# EAGLE design BudgetCANv2.0 (EAGLE 9.6.1)
Therm
CNAME: CANable USB<=>CAN; CREVISION: 0.1; DESIGNER: Ethan Zonca
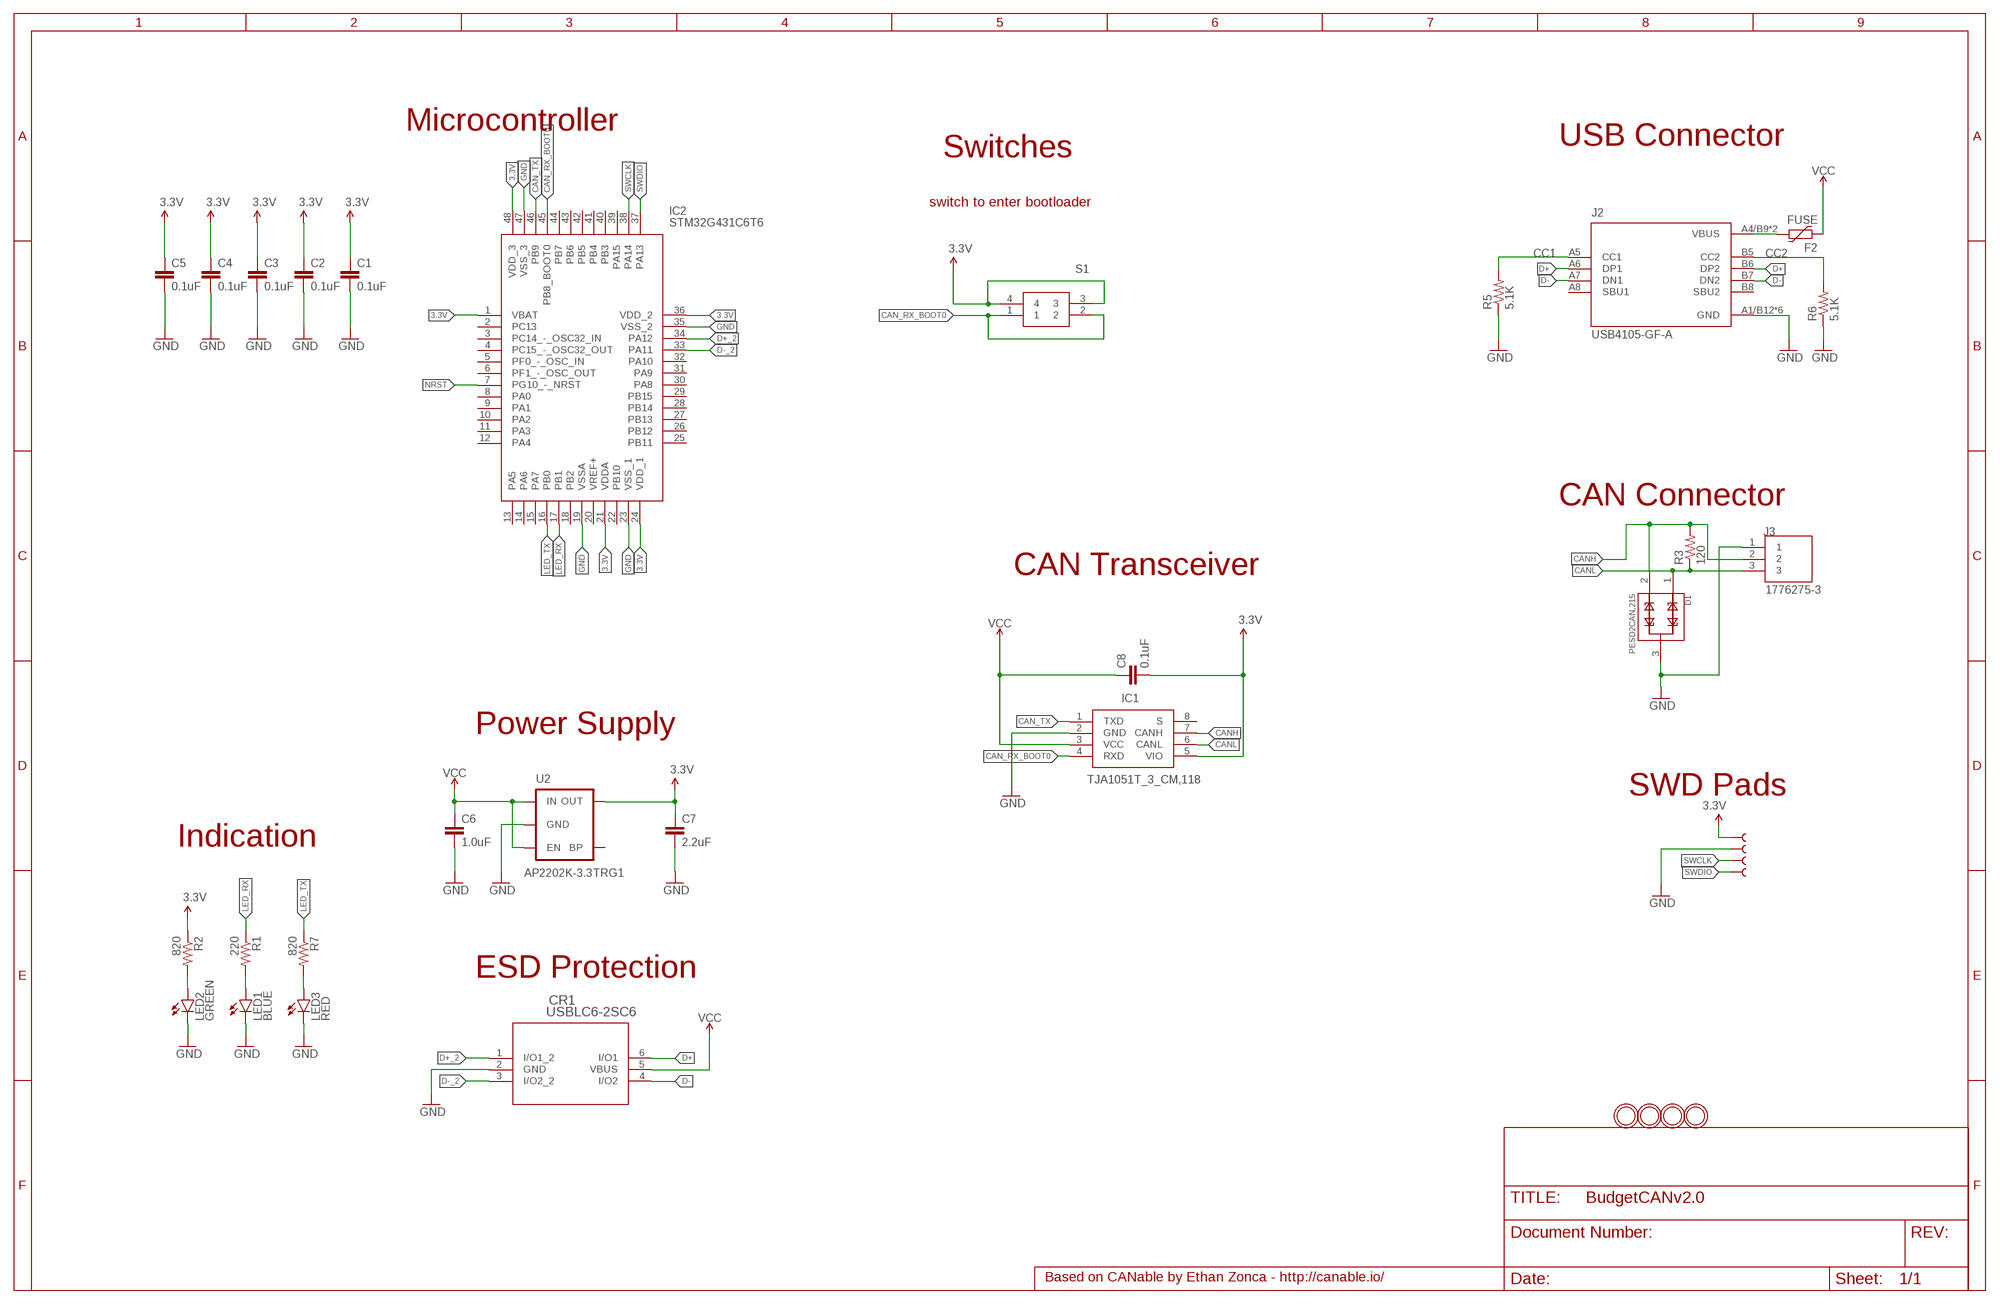
[diagram p0: schematic, sheet 1]

## Parts
C1  0.1uF  CAP0603-CAP  [0603-CAP]
C2  0.1uF  CAP0603-CAP  [0603-CAP]
C3  0.1uF  CAP0603-CAP  [0603-CAP]
C4  0.1uF  CAP0603-CAP  [0603-CAP]
C5  0.1uF  CAP0603-CAP  [0603-CAP]
C6  1.0uF  CAP0603-CAP  [0603-CAP]
C7  2.2uF  CAP0603-CAP  [0603-CAP]
C8  0.1uF  CAP0603-CAP  [0603-CAP]
CR1  USBLC6-2SC6  [SOT23-6L]
D1  PESD2CAN,215  [SOT95P230X110-3N]
F2  FUSE  FUSE_PTC-0805  [PTC0805]
IC1  TJA1051T_3_CM,118  [SOIC127P600X175-8N]
IC2  STM32G431C6T6  [QFP50P900X900X160-48N]
J2  USB4105-GF-A  [GCT_USB4105-GF-A]
J3  1776275-3  [TE_1776275-3]
LED1  BLUE  LED0603  [LED-0603]
LED2  GREEN  LED0603  [LED-0603]
LED3  RED  LED0603  [LED-0603]
R1  220  RESISTOR0603-RES  [0603-RES]
R2  820  RESISTOR0603-RES  [0603-RES]
R3  120  RESISTOR0603-RES  [0603-RES]
R5  5.1K  RESISTOR0603-RES  [0603-RES]
R6  5.1K  RESISTOR0603-RES  [0603-RES]
R7  820  RESISTOR0603-RES  [0603-RES]
S1  KMR631NGULCLFS  [KMR621NG]
TP1  TEST-POINT3X5  [PAD.03X.05]
TP2  TEST-POINT3X5  [PAD.03X.05]
TP3  TEST-POINT3X5  [PAD.03X.05]
TP4  TEST-POINT3X5  [PAD.03X.05]
U2  AP2202K-3.3TRG1  MIC52053.3V  [SOT23-5]
U$2  MOUNTINGHOLE3.0THIN  [MOUNTINGHOLE_3.0_PLATEDTHIN]
U$3  MOUNTINGHOLE3.0THIN  [MOUNTINGHOLE_3.0_PLATEDTHIN]
U$4  MOUNTINGHOLE3.0THIN  [MOUNTINGHOLE_3.0_PLATEDTHIN]
U$5  MOUNTINGHOLE3.0THIN  [MOUNTINGHOLE_3.0_PLATEDTHIN]

## Nets
3.3V: C1.1 C2.1 C3.1 C4.1 C5.1 C7.1 C8.2 IC1.5(VIO) IC2.1(VBAT) IC2.21(VDDA) IC2.24(VDD_1) IC2.36(VDD_2) IC2.48(VDD_3) R2.1 S1.3 S1.4 TP1.P$1 U2.5(OUT)
CAN_RX_BOOT0: IC1.4(RXD) IC2.45(PB8_BOOT0) S1.1 S1.2
CAN_TX: IC1.1(TXD) IC2.46(PB9)
CANH: D1.2 IC1.7(CANH) J3.2 R3.2
CANL: D1.1 IC1.6(CANL) J3.3 R3.1
CC1: J2.A5(CC1) R5.2
CC2: J2.B5(CC2) R6.2
D+: CR1.6(I/O1) J2.A6(DP1) J2.B6(DP2)
D+_2: CR1.1(I/O1_2) IC2.34(PA12)
D-: CR1.4(I/O2) J2.A7(DN1) J2.B7(DN2)
D-_2: CR1.3(I/O2_2) IC2.33(PA11)
GND [power]: C1.2 C2.2 C3.2 C4.2 C5.2 C6.2 C7.2 CR1.2(GND) D1.3 IC1.2(GND) IC2.19(VSSA) IC2.23(VSS_1) IC2.35(VSS_2) IC2.47(VSS_3) J2.A1/B12(GND) J2.B1/A12(GND) J2.G1(GND) J2.G2(GND) J2.G3(GND) J2.G4(GND) J3.1 LED1.C LED2.C LED3.C R5.1 R6.1 TP2.P$1 U2.2(GND)
LED_BLUE: LED1.A R1.2
LED_GREEN: LED2.A R2.2
LED_RED: LED3.A R7.2
LED_RX: IC2.17(PB1) R1.1
LED_TX: IC2.16(PB0) R7.1
NRST: IC2.7(PG10_-_NRST)
SWCLK: IC2.38(PA14) TP3.P$1
SWDIO: IC2.37(PA13) TP4.P$1
VBUS [power]: F2.2 J2.A4/B9(VBUS) J2.B4/A9(VBUS)
VCC [power]: C6.1 C8.1 CR1.5(VBUS) F2.1 IC1.3(VCC) U2.1(IN) U2.3(EN)
Unconnected: IC1.8(S) IC2.2(PC13) IC2.3(PC14_-_OSC32_IN) IC2.4(PC15_-_OSC32_OUT) IC2.5(PF0_-_OSC_IN) IC2.6(PF1_-_OSC_OUT) IC2.8(PA0) IC2.9(PA1) IC2.10(PA2) IC2.11(PA3) IC2.12(PA4) IC2.13(PA5) IC2.14(PA6) IC2.15(PA7) IC2.18(PB2) IC2.20(VREF+) IC2.22(PB10) IC2.25(PB11) IC2.26(PB12) IC2.27(PB13) IC2.28(PB14) IC2.29(PB15) IC2.30(PA8) IC2.31(PA9) IC2.32(PA10) IC2.39(PA15) IC2.40(PB3) IC2.41(PB4) IC2.42(PB5) IC2.43(PB6) IC2.44(PB7) J2.A8(SBU1) J2.B8(SBU2) U2.4(BP)

## Notes on the sheet
- Microcontroller
- USB Connector
- Switches
- switch to enter bootloader
- CAN Connector
- CAN Transceiver
- Power Supply
- SWD Pads
- Indication
- ESD Protection
- Based on CANable by Ethan Zonca - http://canable.io/

## Library data of the parts
C1-C8 = SparkFun-Passives:CAP: Capacitor Standard 0603 ceramic capacitor, and 0.1" leaded capacitor.
CR1 = USBLC6-2SC6:USBLC6-2SC6; BUILT_BY: EMA_UL_Team; MANUFACTURER_PART_NUMBER: USBLC6-2SC6; VENDOR: STMicroelectronics
D1 = PESD2CAN_215:PESD2CAN,215: PESD2CAN,215 Series 2 Channel Bi-Directional CAN Bus ESD Protection Diode - SOT-23-3; DESCRIPTION: 41V Clamp 5A _8/20µs_ Ipp Tvs Diode Surface Mount TO-236AB; DIGI-KEY_PART_NUMBER: 1727-3891-1-ND; DIGI-KEY_PURCHASE_URL: https://www.digikey.com/product-detail/en/nexperia-usa-inc/PESD2CAN,215/1727-3891-1-ND/1589996?utm_source=snapeda&utm_medium=aggregator&utm_campaign=symbol; MF: Nexperia USA; MP: PESD2CAN,215; PACKAGE: SOT-23-3 Nexperia
F2 = dp_devices:FUSE_PTC: Resettable PTC
IC1 = SamacSys_Parts:TJA1051T_3_CM,118: CAN Interface IC BL Advanced Automotive Analog Source: Datasheet <http://www.nxp.com/docs/en/data-sheet/TJA1051.pdf>; DESCRIPTION: CAN Interface IC BL Advanced Automotive Analog; HEIGHT: 1.75mm; MANUFACTURER_NAME: NXP; MANUFACTURER_PART_NUMBER: TJA1051T/3/CM,118; MOUSER_PART_NUMBER: 771-TJA1051T/3CM118; MOUSER_PRICE-STOCK: https://www.mouser.co.uk/ProductDetail/NXP-Semiconductors/TJA1051T-3-CM118?qs=5XOdhvmYM0NUkmo%252BpXvJfw%3D%3D
IC2 = SamacSys_Parts:STM32G431C6T6: ARM Microcontrollers - MCU Source: Datasheet <https://componentsearchengine.com/Datasheets/1/STM32G431C6T6.pdf>; DESCRIPTION: ARM Microcontrollers - MCU; HEIGHT: 1.6mm; MANUFACTURER_NAME: STMicroelectronics; MANUFACTURER_PART_NUMBER: STM32G431C6T6; MOUSER_PART_NUMBER: 511-STM32G431C6T6; MOUSER_PRICE-STOCK: https://www.mouser.co.uk/ProductDetail/STMicroelectronics/STM32G431C6T6?qs=uwxL4vQweFMIHkXLHKxSFQ%3D%3D
J2 = USB4105-GF-A:USB4105-GF-A: USB Type C Receptacle for USB 2.0 SMT Type, PCB Top Mount; DESCRIPTION: USB-C _USB TYPE-C_ USB 2.0 Receptacle Connector 24 _16+8 Dummy_ Position Surface Mount, Right Angle; Through Hole; DIGI-KEY_PART_NUMBER: 2073-USB4105-GF-ACT-ND; DIGI-KEY_PURCHASE_URL: https://www.digikey.com/product-detail/en/gct/USB4105-GF-A/2073-USB4105-GF-ACT-ND/11198510?utm_source=snapeda&utm_medium=aggregator&utm_campaign=symbol; MF: GCT; MP: USB4105-GF-A; PACKAGE: None
J3 = 1776275-3:1776275-3; AVAILABILITY: Unavailable; COMMENT: 1776275-3; DESCRIPTION: Wire-To-Board Terminal Block, 3, 250 V, 7 A, 22 Awg, 14 Awg, 2 Mm; MF: TE Connectivity; MP: 1776275-3; PACKAGE: None; PRICE: None; TE_PURCHASE_URL: https://www.te.com/usa-en/product-1776275-3.html?te_bu=Cor&te_type=disp&te_campaign=seda_glo_cor-seda-global-disp-prtnr-fy19-seda-model-bom-cta_sma-317_1&elqCampaignId=32493
LED1-LED3 = SparkFun-LED:LED: LED (Generic) Standard schematic elements and footprints for 5mm, 3mm, 1206, and 0603 sized LEDs. Generic LEDs with no color specified.
R1-R3 R5-R7 = SparkFun-Passives:RESISTOR: Resistor Basic schematic elements and footprints for 0603, 1206, and PTH resistors.
S1 = SamacSys_Parts:KMR631NGULCLFS: KMR631NGULCLFS (Tactile Switches) Source: Datasheet <https://www.ckswitches.com/media/1907/kmr6.pdf>; DESCRIPTION: KMR631NGULCLFS (Tactile Switches); HEIGHT: mm; MANUFACTURER_NAME: C & K COMPONENTS; MANUFACTURER_PART_NUMBER: KMR631NGULCLFS; MOUSER_PART_NUMBER: 611-KMR631NGULCLFS; MOUSER_PRICE-STOCK: https://www.mouser.co.uk/ProductDetail/CK/KMR631NGULCLFS?qs=HXFqYaX1Q2xBA5gT0%2FzYzA%3D%3D
TP1-TP4 = SparkFun-Connectors:TEST-POINT: SparkFun Test Points Bare copper test points for troubleshooting or In-Circuit-Testing. These are used by our Production team for verifying production board runs using pogo-pins on test beds. SparkFun Products: SparkFun LSM9DS1 Breakout <https://www.sparkfun.com/products/13284> SparkFun PSOC <https://www.sparkfun.com/products/13714> SparkFun Load Cell Amplifier <https://www.sparkfun.com/products/13879>
U2 = SparkFun-PowerIC:MIC5205: MIC5205 150mA vreg 3.3V - VREG-00822 5V - VREG-00823; PROD_ID: VREG-00822
U$2-U$5 = microbuilder:MOUNTINGHOLE: Mounting Hole For #2 screws (0.086"/2.18mm width, 0.094"/2.4mm hole) use 2.5mm

## Net classes
0 default: width 0.254 mm
1 power: width 0.406 mm

## Board
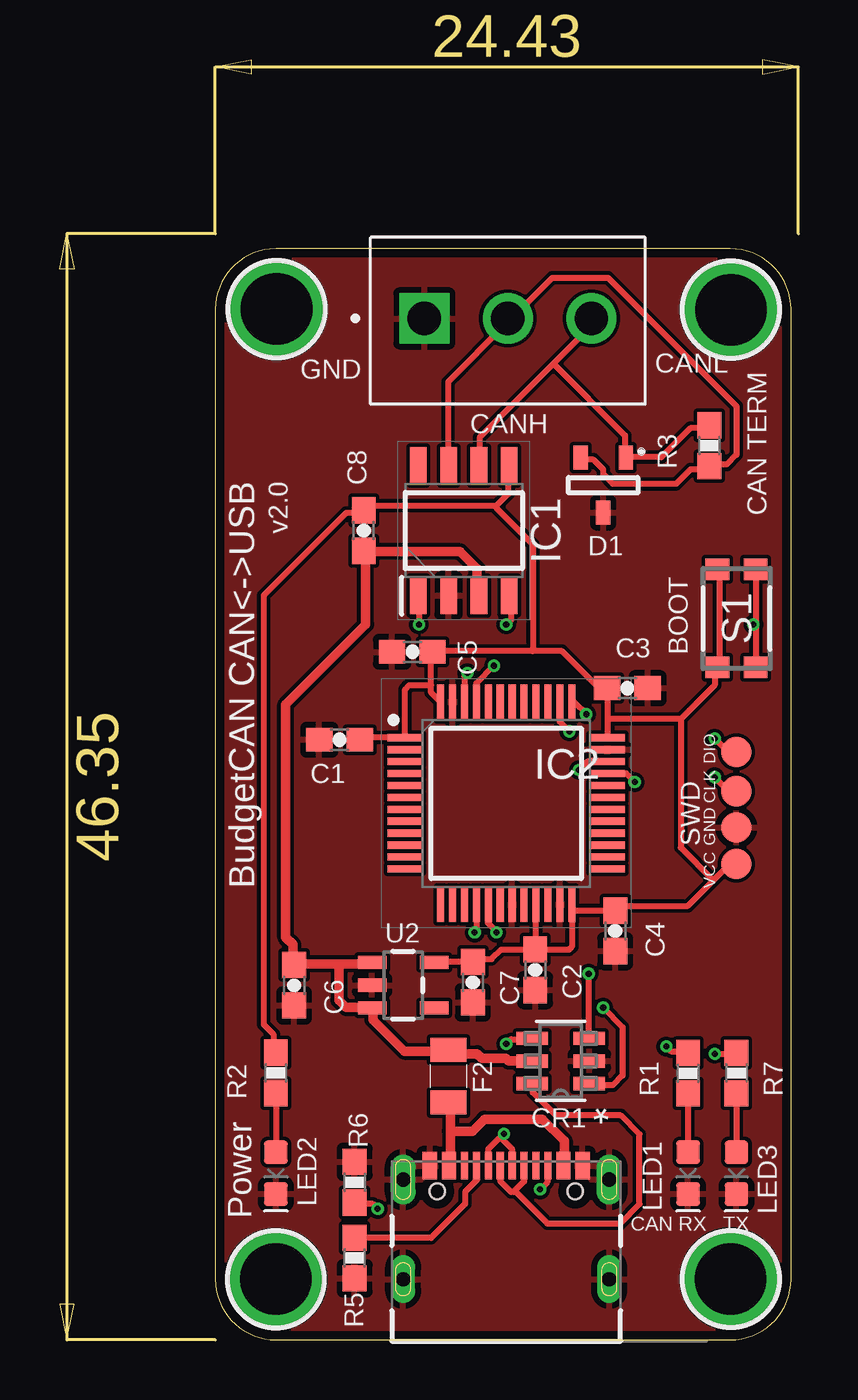
[diagram p1: board, top side]
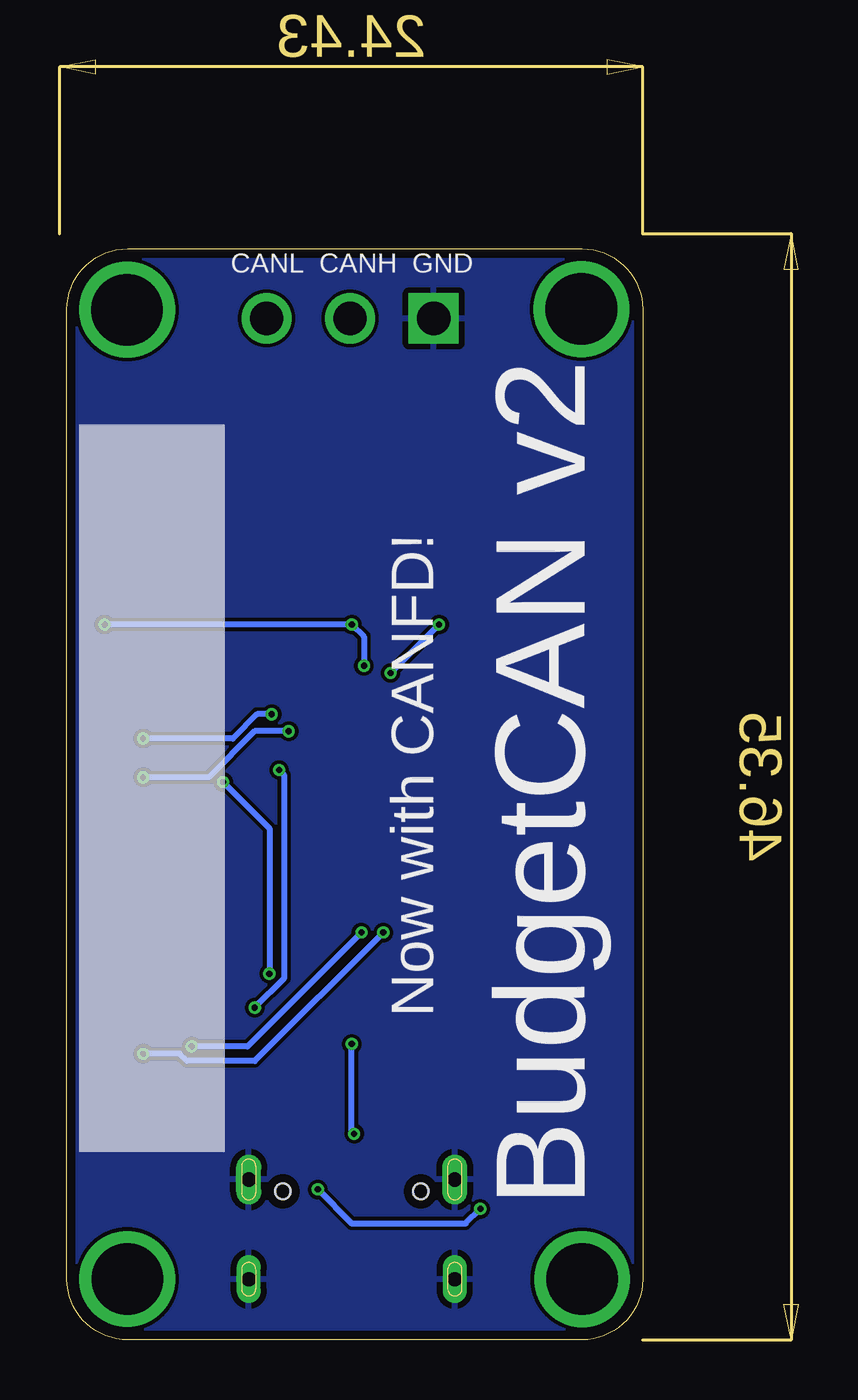
[diagram p2: board, bottom side, seen from below]

Size 24.13 x 45.72 mm. Coordinates in mm from the lower left corner, seen from the top.
Outline: 0,2.54 arc90 2.54,0 21.59,0 arc90 24.13,2.54 24.13,43.18 arc90 21.59,45.72 2.54,45.72 arc90 0,43.18 0,2.54
Copper layers (1*16): Top 0.035559375mm / dielectric 1.6mm / Bottom 0.035559375mm
Design rules "oshpark-2layer": minimum track width 6mil, minimum drill 10mil, track to track 6mil, track to pad 6mil, pad to pad 6mil, via to via 6mil, smd to smd 6mil, copper to edge 15mil, drill to drill 6mil, minimum pad ring 5mil, minimum via ring 5mil, stop-mask expansion 2.5mil, vias tented up to drill 0mil, thermal gap 10mil

### Footprints (pad centres in the part's own frame; a part is rotated, then mirrored left to right if it is on the bottom)
0603-CAP = smd 1.1 x 1: 1 -0.85,0; 2 0.85,0
SOT23-6L = smd 1.321 x 0.559: 1 -1.194,0.95; 2 -1.194,0; 3 -1.194,-0.95; 4 1.194,-0.95; 5 1.194,0; 6 1.194,0.95
SOT95P230X110-3N = smd 1 x 0.6: 1 -1.15,0.95; 2 -1.15,-0.95; 3 1.15,0
PTC0805 = smd 1 x 1.5: 1 -1.1,0; 2 1.1,0
SOIC127P600X175-8N = smd 1.55 x 0.7: 1 -2.725,1.905; 2 -2.725,0.635; 3 -2.725,-0.635; 4 -2.725,-1.905; 5 2.725,-1.905; 6 2.725,-0.635; 7 2.725,0.635; 8 2.725,1.905
QFP50P900X900X160-48N = smd 1.475 x 0.3: 1 -4.238,2.75; 2 -4.238,2.25; 3 -4.238,1.75; 4 -4.238,1.25; 5 -4.238,0.75; 6 -4.238,0.25; 7 -4.238,-0.25; 8 -4.238,-0.75; 9 -4.238,-1.25; 10 -4.238,-1.75; 11 -4.238,-2.25; 12 -4.238,-2.75; 25 4.238,-2.75; 26 4.238,-2.25; 27 4.238,-1.75; 28 4.238,-1.25; 29 4.238,-0.75; 30 4.238,-0.25; 31 4.238,0.25; 32 4.238,0.75; 33 4.238,1.25; 34 4.238,1.75; 35 4.238,2.25; 36 4.238,2.75 | smd 0.3 x 1.475: 13 -2.75,-4.238; 14 -2.25,-4.238; 15 -1.75,-4.238; 16 -1.25,-4.238; 17 -0.75,-4.238; 18 -0.25,-4.238; 19 0.25,-4.238; 20 0.75,-4.238; 21 1.25,-4.238; 22 1.75,-4.238; 23 2.25,-4.238; 24 2.75,-4.238; 37 2.75,4.238; 38 2.25,4.238; 39 1.75,4.238; 40 1.25,4.238; 41 0.75,4.238; 42 0.25,4.238; 43 -0.25,4.238; 44 -0.75,4.238; 45 -1.25,4.238; 46 -1.75,4.238; 47 -2.25,4.238; 48 -2.75,4.238
GCT_USB4105-GF-A = smd 0.6 x 1.15: A1/B12 -3.2,4.755; A4/B9 -2.4,4.755; B1/A12 3.2,4.755; B4/A9 2.4,4.755 | smd 0.3 x 1.15: A5 -1.25,4.755; A6 -0.25,4.755; A7 0.25,4.755; A8 1.25,4.755; B5 1.75,4.755; B6 0.75,4.755; B7 -0.75,4.755; B8 -1.75,4.755 | drill 0.6 pad 1 long: G1 -4.32,0; G2 4.32,0 | drill 0.6 pad 1.05 long: G3 -4.32,4.18; G4 4.32,4.18 | hole 0.65: 2.89,3.68; -2.89,3.68
TE_1776275-3 = drill 1.4 pad 1.75 square: 1 0,0 | drill 1.4 pad 1.75: 2 3.5,0; 3 7,0
LED-0603 = smd 1 x 1: A -0.877,0; C 0.877,0
0603-RES = smd 1.1 x 1: 1 -0.85,0; 2 0.85,0
KMR621NG = smd 0.9 x 1: 1 -2.05,-0.8; 2 2.05,-0.8; 3 2.05,0.8; 4 -2.05,0.8
PAD.03X.05 = smd 1.27 x 1.27: P$1 0,0
SOT23-5 = smd 0.55 x 1.2: 1 -0.95,-1.3; 2 0,-1.3; 3 0.95,-1.3; 4 0.95,1.3; 5 -0.95,1.3
MOUNTINGHOLE_3.0_PLATEDTHIN = drill 3 pad 3.6: P$1 0,0

### Placement (x,y rotation side)
C1  5.21,25.15 180 top
C2  13.41,15.5 270 top
C3  17.27,27.3 0 top
C4  16.76,17.14 270 top
C5  8.26,28.83 180 top
C6  3.3,14.86 270 top
C7  10.79,14.99 270 top
C8  6.22,33.91 90 top
CR1  14.48,11.68 180 top
D1  16.26,35.81 270 top
F2  9.78,11.05 270 top
IC1  10.41,33.91 90 top
IC2  12.19,22.48 0 top
J2  12.19,2.54 0 top
J3  8.76,42.8 0 top
LED1  19.81,6.99 270 top
LED2  2.54,6.99 270 top
LED3  21.84,6.99 270 top
R1  19.81,11.17 270 top
R2  2.53,11.18 270 top
R3  20.7,37.47 270 top
R5  5.84,3.43 90 top
R6  5.84,6.6 270 top
R7  21.84,11.18 270 top
S1  21.84,30.23 90 top
TP1  21.84,19.94 0 top
TP2  21.84,21.46 0 top
TP3  21.84,22.99 0 top
TP4  21.84,24.64 0 top
U2  7.87,14.86 270 top
U$2  2.53,2.54 0 top
U$3  21.6,2.55 0 top
U$4  2.57,43.19 0 top
U$5  21.61,43.16 0 top

### Tracks (layer width: path | path; a pad name or v marks a point on that pad's centre or on a via)
3.3V
  Top 0.254: U2.5 9.25,15.85 10.77,15.85 C7.1 10.77,15.95 11.58,15.95 11.99,16.36 13.31,16.36 C2.1 | IC2.21 13.44,16.36 C2.1 | 20.88,19.25 19.81,18.19 17.07,18.19 16.87,17.98 C4.1 15.04,17.98 14.94,18.09 14.94,18.19 IC2.24 14.94,16.47 14.83,16.35 C2.1 | 20.88,19.25 21.54,19.91 21.84,19.91 TP1.P$1 | C1.1 6.12,25.23 IC2.1 7.95,27.26 8.13,27.43 9.04,27.43 | 16.46,26.01 16.46,25.3 IC2.36 | 16.46,26.01 16.46,27.23 C3.1 16.36,27.33 16.05,27.33 14.53,28.85 13.31,28.85 | S1.3 21.13,32.21 21.13,28.25 S1.4 20.93,28.14 20.93,27.43 19.51,26.01 | 19.51,26.01 16.46,26.01 | 13.31,28.85 9.14,28.85 C5.1 9.04,28.75 9.04,27.43 | 20.88,19.25 19.51,20.62 19.51,26.01 | R2.1 2.44,12.09 2.44,12.8 2.03,13.21 2.03,31.19 5.49,34.65 6.1,34.65 6.2,34.75 C8.2 6.3,34.85 6.4,34.95 11.79,34.95 | 11.79,34.95 12.29,35.46 12.29,36.58 IC1.5 | 13.31,28.85 13.31,33.33 11.79,34.85 11.79,34.95 | IC2.48 9.04,27.12 9.04,27.43
CAN_RX_BOOT0  (via drill 0.25)
  Top 0.254: 22.66,29.97 22.66,32.21 S1.2 | 22.66,29.97 22.66,28.25 S1.1 | IC2.45 10.94,27.5 v11.68,28.25 | v12.19,29.97 12.39,30.18 12.39,31.09 IC1.4 | IC2.45 | v22.55,29.97 22.66,29.97
  Bottom 0.254: v11.68,28.25 11.68,29.46 v12.19,29.97 v22.55,29.97
CAN_TX  (via drill 0.25)
  Top 0.254: IC2.46 10.44,27.81 v10.57,27.94 | IC2.46 | v8.53,29.97 8.53,31.09 IC1.1
  Bottom 0.254: v8.53,29.97 v10.57,27.94
CANH
  Top 0.254: D1.2 15.34,36.88 15.85,36.88 16.26,36.47 16.26,36.27 16.66,35.87 19.3,35.87 19.91,36.47 20.52,36.47 20.62,36.58 R3.2 20.73,36.68 21.44,36.68 21.84,37.08 21.84,39.12 16.46,44.5 14.12,44.5 12.29,42.67 J3.2 12.19,42.77 12.19,42.57 9.75,40.13 9.75,36.68 IC1.7
CANL
  Top 0.254: R3.1 20.62,38.3 20.52,38.2 19.91,38.2 18.69,36.98 17.27,36.98 D1.1 17.17,37.08 17.17,37.9 14.17,40.89 | 14.17,40.89 15.75,42.47 15.75,42.77 J3.3 | 14.17,40.89 11.07,37.8 11.07,36.68 IC1.6
CC1
  Top 0.254: R5.2 5.89,4.27 9.04,4.27 10.46,5.69 10.46,6.2 10.97,6.71 10.97,7.21 J2.A5
CC2  (via drill 0.25)
  Top 0.254: v6.81,5.49 6.6,5.69 5.89,5.69 R6.2 | v13.61,6.3 13.92,6.6 13.92,7.21 J2.B5
  Bottom 0.254: v6.81,5.49 7.42,4.88 12.19,4.88 v13.61,6.3
D+
  Top 0.254: J2.A6 11.94,6.65 12.39,6.2 12.5,6.2 | 12.5,6.2 12.94,6.64 J2.B6 | CR1.6 13.31,10.67 13.31,10.36 14.28,9.4 16.99,9.4 17.78,8.61 17.78,5.69 16.97,4.88 13.92,4.88 12.6,6.2 12.5,6.2
D+_2  (via drill 0.25)
  Top 0.254: v16.26,13.92 17.07,13.11 17.07,11.07 16.66,10.67 15.75,10.67 CR1.1 | v15.24,23.88 15.59,24.23 IC2.34 | IC2.34
  Bottom 0.254: v16.26,13.92 15.04,15.14 15.04,23.67 v15.24,23.88
D-  (via drill 0.25)
  Top 0.254: J2.B7 11.44,7.98 11.89,8.43 11.99,8.43 | 11.99,8.43 12.44,7.98 J2.A7 | v12.19,12.39 12.39,12.6 13.21,12.6 CR1.4 | v12.09,8.64 11.99,8.53 11.99,8.43
  Bottom 0.254: v12.19,12.39 12.19,8.74 v12.09,8.64
D-_2  (via drill 0.25)
  Top 0.254: v15.65,15.34 15.65,12.7 CR1.3 | v17.58,23.37 17.21,23.73 IC2.33
  Bottom 0.254: v15.65,15.34 15.65,21.44 v17.58,23.37
GND
  pour Top: -1.14,48.51 -1.14,-1.27 27.43,-1.27 27.43,48.51
  pour Bottom: -1.14,48.39 27.43,48.39 27.43,-1.27 -1.14,-1.27
LED_BLUE
  Top 0.254: LED1.A 19.81,10.26 R1.2
LED_GREEN
  Top 0.254: LED2.A 2.54,10.26 R2.2
LED_RED
  Top 0.254: R7.2 21.84,7.92 LED3.A
LED_RX  (via drill 0.25)
  Top 0.254: v18.9,12.29 19.1,12.09 19.81,12.09 R1.1 | v11.79,17.07 11.79,17.11 11.42,17.48 11.44,17.5 IC2.17
  Bottom 0.254: v18.9,12.29 16.56,12.29 v11.79,17.07
LED_TX  (via drill 0.25)
  Top 0.254: v20.93,11.99 21.84,11.99 R7.1 | v10.87,17.07 10.95,17.14 IC2.16
  Bottom 0.254: v20.93,11.99 19.41,11.99 19.1,11.68 16.26,11.68 v10.87,17.07
SWCLK  (via drill 0.25)
  Top 0.254: v20.93,23.57 21.44,23.06 21.84,23.06 TP3.P$1 | v14.83,25.5 14.44,25.89 IC2.38 | IC2.38
  Bottom 0.254: v20.93,23.57 18.19,23.57 16.26,25.5 v14.83,25.5
SWDIO  (via drill 0.25)
  Top 0.254: v20.93,25.2 21.44,24.69 21.84,24.69 TP4.P$1 | v15.54,26.21 15.04,26.72 IC2.37
  Bottom 0.254: v20.93,25.2 17.17,25.2 16.15,26.21 v15.54,26.21
VBUS
  Top 0.406: 9.86,8.74 9.86,7.32 J2.A4/B9 | 9.86,8.74 9.86,9.86 F2.2 | 9.86,8.74 10.77,8.74 11.28,9.25 13.72,9.25 14.63,8.33 14.63,7.82 14.53,7.72 14.53,7.32 J2.B4/A9
VCC
  Top 0.406: IC1.3 10.97,31.19 10.97,32.31 10.26,33.02 6.3,33.02 C8.1 6.3,32.82 6.3,29.97 2.95,26.62 2.95,16.87 3.25,16.56 3.25,15.85 C6.1 3.35,15.75 5.18,15.75 | CR1.5 12.29,11.68 12.19,11.79 11.18,11.79 10.97,11.99 9.96,11.99 9.86,12.09 F2.1 9.65,12.09 7.92,12.09 6.6,13.41 6.6,13.72 U2.3 6.5,13.92 5.49,13.92 5.18,14.22 5.18,15.75 | 5.18,15.75 6.5,15.75 U2.1

### Text on the board
tPlace: CANL | GND | CANH | CAN TERM | v2.0 | BOOT | DIO | CLK | SWD | GND | BudgetCAN CAN<->USB | VCC | Power | CAN RX TX
bPlace: Now with CANFD! | BudgetCAN v2
bNames: CANL CANH GND